# EAGLE design AS3364 bus mixer v2.1 (EAGLE 9.6.2)
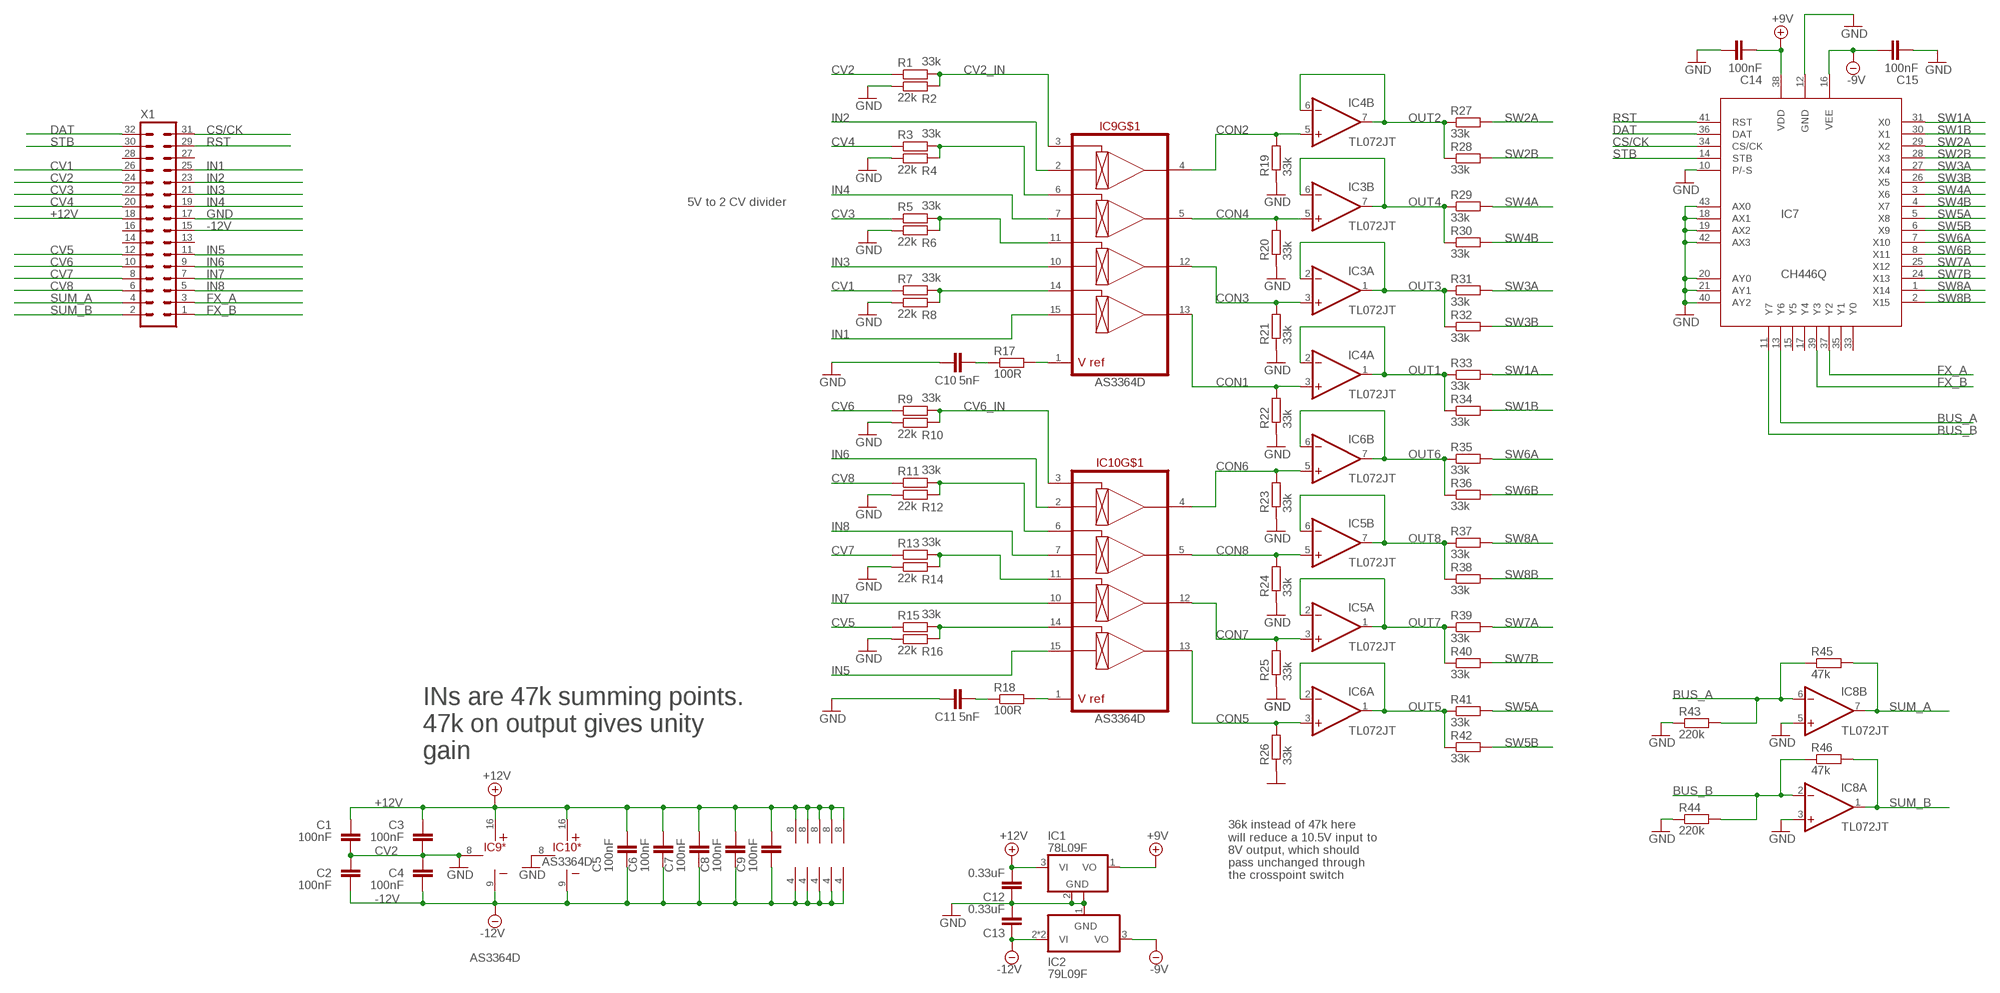
[diagram p0: schematic, sheet 1]

## Parts
C1  100nF  C-EUC0402  [C0402]
C2  100nF  C-EUC0402  [C0402]
C3  100nF  C-EUC0402  [C0402]
C4  100nF  C-EUC0402  [C0402]
C5  100nF  C-EUC0402  [C0402]
C6  100nF  C-EUC0402  [C0402]
C7  100nF  C-EUC0402  [C0402]
C8  100nF  C-EUC0402  [C0402]
C9  100nF  C-EUC0402  [C0402]
C10  5nF  C-EUC0402  [C0402]
C11  5nF  C-EUC0402  [C0402]
C12  0.33uF  C-EUC0603  [C0603]
C13  0.33uF  C-EUC0603  [C0603]
C14  100nF  C-EUC0402  [C0402]
C15  100nF  C-EUC0402  [C0402]
IC1  78L09F  [SOT89]
IC2  79L09F  [SOT89]
IC3  TL072JT  [TSSOP8J]
IC4  TL072JT  [TSSOP8J]
IC5  TL072JT  [TSSOP8J]
IC6  TL072JT  [TSSOP8J]
IC7  CH446Q  [LQFP-44-J]
IC8  TL072JT  [TSSOP8J]
IC9  AS3364D  [DIL16J]
IC10  AS3364D  [DIL16J]
R1  33k  R-EU_R0402  [R0402]
R2  22k  R-EU_R0402  [R0402]
R3  33k  R-EU_R0402  [R0402]
R4  22k  R-EU_R0402  [R0402]
R5  33k  R-EU_R0402  [R0402]
R6  22k  R-EU_R0402  [R0402]
R7  33k  R-EU_R0402  [R0402]
R8  22k  R-EU_R0402  [R0402]
R9  33k  R-EU_R0402  [R0402]
R10  22k  R-EU_R0402  [R0402]
R11  33k  R-EU_R0402  [R0402]
R12  22k  R-EU_R0402  [R0402]
R13  33k  R-EU_R0402  [R0402]
R14  22k  R-EU_R0402  [R0402]
R15  33k  R-EU_R0402  [R0402]
R16  22k  R-EU_R0402  [R0402]
R17  100R  R-EU_R0402  [R0402]
R18  100R  R-EU_R0402  [R0402]
R19  33k  R-EU_R0402  [R0402]
R20  33k  R-EU_R0402  [R0402]
R21  33k  R-EU_R0402  [R0402]
R22  33k  R-EU_R0402  [R0402]
R23  33k  R-EU_R0402  [R0402]
R24  33k  R-EU_R0402  [R0402]
R25  33k  R-EU_R0402  [R0402]
R26  33k  R-EU_R0402  [R0402]
R27  33k  R-EU_R0402  [R0402]
R28  33k  R-EU_R0402  [R0402]
R29  33k  R-EU_R0402  [R0402]
R30  33k  R-EU_R0402  [R0402]
R31  33k  R-EU_R0402  [R0402]
R32  33k  R-EU_R0402  [R0402]
R33  33k  R-EU_R0402  [R0402]
R34  33k  R-EU_R0402  [R0402]
R35  33k  R-EU_R0402  [R0402]
R36  33k  R-EU_R0402  [R0402]
R37  33k  R-EU_R0402  [R0402]
R38  33k  R-EU_R0402  [R0402]
R39  33k  R-EU_R0402  [R0402]
R40  33k  R-EU_R0402  [R0402]
R41  33k  R-EU_R0402  [R0402]
R42  33k  R-EU_R0402  [R0402]
R43  220k  R-EU_R0402  [R0402]
R44  220k  R-EU_R0402  [R0402]
R45  47k  R-EU_R0402  [R0402]
R46  47k  R-EU_R0402  [R0402]
X1  MA16-2WJ  [MA16-2WJ]

## Nets
+9V: C14.1 IC1.1(VO) IC7.38(VDD)
+12V: C1.2 C3.2 C5.2 C6.2 C7.2 C8.2 C9.2 C12.2 IC1.3(VI) IC3.8(P:V+) IC4.8(P:V+) IC5.8(P:V+) IC6.8(P:V+) IC8.8(P:V+) IC9.16(*:V+) IC10.16(*:V+) X1.18
-9V: C15.2 IC2.3(VO) IC7.16(VEE)
-12V: C2.1 C4.1 C5.1 C6.1 C7.1 C8.1 C9.1 C13.1 IC2.2(VI) IC2.2@1(VI) IC3.4(P:V-) IC4.4(P:V-) IC5.4(P:V-) IC6.4(P:V-) IC8.4(P:V-) IC9.9(*:V-) IC10.9(*:V-) X1.15
BUS_A: IC7.13(Y6) IC8.6(B:-IN) R43.2 R45.1
BUS_B: IC7.11(Y7) IC8.2(A:-IN) R44.2 R46.1
CON1: IC4.3(A:+IN) IC9.13(OUT4) R22.2
CON2: IC4.5(B:+IN) IC9.4(OUT1) R19.2
CON3: IC3.3(A:+IN) IC9.12(OUT3) R21.2
CON4: IC3.5(B:+IN) IC9.5(OUT2) R20.2
CON5: IC6.3(A:+IN) IC10.13(OUT4) R26.2
CON6: IC6.5(B:+IN) IC10.4(OUT1) R23.2
CON7: IC5.3(A:+IN) IC10.12(OUT3) R25.2
CON8: IC5.5(B:+IN) IC10.5(OUT2) R24.2
CS/CK: IC7.34(CS/CK) X1.31
CV1: R7.1 X1.26
CV2: R1.1 X1.24
CV2_IN: IC9.3(CV1) R1.2 R2.2
CV3: R5.1 X1.22
CV4: R3.1 X1.20
CV5: R15.1 X1.12
CV6: R9.1 X1.10
CV6_IN: IC10.3(CV1) R9.2 R10.2
CV7: R13.1 X1.8
CV8: R11.1 X1.6
DAT: IC7.36(DAT) X1.32
FX_A: IC7.37(Y2) X1.3
FX_B: IC7.39(Y3) X1.1
GND: C1.1 C2.2 C3.1 C4.2 C10.1 C11.1 C12.1 C13.2 C14.2 C15.1 IC1.2(GND) IC1.2@1(GND) IC2.1(GND) IC7.10(P/-S) IC7.12(GND) IC7.18(AX1) IC7.19(AX2) IC7.20(AY0) IC7.21(AY1) IC7.40(AY2) IC7.42(AX3) IC7.43(AX0) IC8.3(A:+IN) IC8.5(B:+IN) IC9.8(*:GND) IC10.8(*:GND) R2.1 R4.1 R6.1 R8.1 R10.1 R12.1 R14.1 R16.1 R19.1 R20.1 R21.1 R22.1 R23.1 R24.1 R25.1 R26.1 R43.1 R44.1 X1.17
IN1: IC9.15(IN4) X1.25
IN2: IC9.2(IN1) X1.23
IN3: IC9.10(IN3) X1.21
IN4: IC9.7(IN2) X1.19
IN5: IC10.15(IN4) X1.11
IN6: IC10.2(IN1) X1.9
IN7: IC10.10(IN3) X1.7
IN8: IC10.7(IN2) X1.5
N$1: IC10.1(VREF) R18.2
N$2: IC9.1(VREF) R17.2
N$3: IC10.6(CV2) R11.2 R12.2
N$5: IC10.11(CV3) R13.2 R14.2
N$7: IC10.14(CV4) R15.2 R16.2
N$8: C11.2 R18.1
N$10: IC9.6(CV2) R3.2 R4.2
N$12: IC9.11(CV3) R5.2 R6.2
N$14: C10.2 R17.1
N$21: IC9.14(CV4) R7.2 R8.2
OUT1: IC4.1(A:OUT) IC4.2(A:-IN) R33.1 R34.1
OUT2: IC4.6(B:-IN) IC4.7(B:OUT) R27.1 R28.1
OUT3: IC3.1(A:OUT) IC3.2(A:-IN) R31.1 R32.1
OUT4: IC3.6(B:-IN) IC3.7(B:OUT) R29.1 R30.1
OUT5: IC6.1(A:OUT) IC6.2(A:-IN) R41.1 R42.1
OUT6: IC6.6(B:-IN) IC6.7(B:OUT) R35.1 R36.1
OUT7: IC5.1(A:OUT) IC5.2(A:-IN) R39.1 R40.1
OUT8: IC5.6(B:-IN) IC5.7(B:OUT) R37.1 R38.1
RST: IC7.41(RST) X1.29
STB: IC7.14(STB) X1.30
SUM_A: IC8.7(B:OUT) R45.2 X1.4
SUM_B: IC8.1(A:OUT) R46.2 X1.2
SW1A: IC7.31(X0) R33.2
SW1B: IC7.30(X1) R34.2
SW2A: IC7.29(X2) R27.2
SW2B: IC7.28(X3) R28.2
SW3A: IC7.27(X4) R31.2
SW3B: IC7.26(X5) R32.2
SW4A: IC7.3(X6) R29.2
SW4B: IC7.4(X7) R30.2
SW5A: IC7.5(X8) R41.2
SW5B: IC7.6(X9) R42.2
SW6A: IC7.7(X10) R35.2
SW6B: IC7.8(X11) R36.2
SW7A: IC7.25(X12) R39.2
SW7B: IC7.24(X13) R40.2
SW8A: IC7.1(X14) R37.2
SW8B: IC7.2(X15) R38.2
Unconnected: IC7.15(Y5) IC7.17(Y4) IC7.33(Y0) IC7.35(Y1) X1.13 X1.14 X1.16 X1.27 X1.28

## Notes on the sheet
- 5V to 2 CV divider
- INs are 47k summing points.
  47k on output gives unity
  gain
- 36k instead of 47k here 
  will reduce a 10.5V input to
  8V output, which should
  pass unchanged through
  the crosspoint switch

## Library data of the parts
C1-C11 C14 C15 = rcl:C-EU: CAPACITOR, European symbol; SPICEPREFIX: C
C12 C13 = resistor:C-EU: CAPACITOR, European symbol
IC1 = linear:78L*: POSITOIV-VOLTAGE REGULATORS Output up to 100 mA Source: Datasheet <http://focus.ti.com/lit/ds/symlink/ua78l05.pdf>
IC2 = joakim:79L*: NEGATIVE-VOLTAGE REGULATORS Output up to 100 mA
IC3-IC6 IC8 = joakim:TL072J: OP AMP
IC7 = joakim:CH446Q: 8x16 matrix analog switch chip, contains 128 analog switches, used for arbitrary routing of 8x16 signal channels. CH446 supports 4V to 12V single supply voltage, and supports +5V and -7V dual power supply voltage. The ON resistance is not greater than 65Ω. https://www.wch-ic.com/downloads/CH446DS1_PDF.html
IC9 IC10 = joakim:AS3364: AS3364 quad linear VCA, CEM3360 style. CV is 0 to 2V Vcc-Vee = 26V max, so +/-12V or +15V/-9V
R1-R46 = rcl:R-EU_: RESISTOR, European symbol; SPICEPREFIX: R
X1 = joakim:MA16-2WJ: PIN HEADER; OC_FARNELL: unknown; OC_NEWARK: unknown

## Board
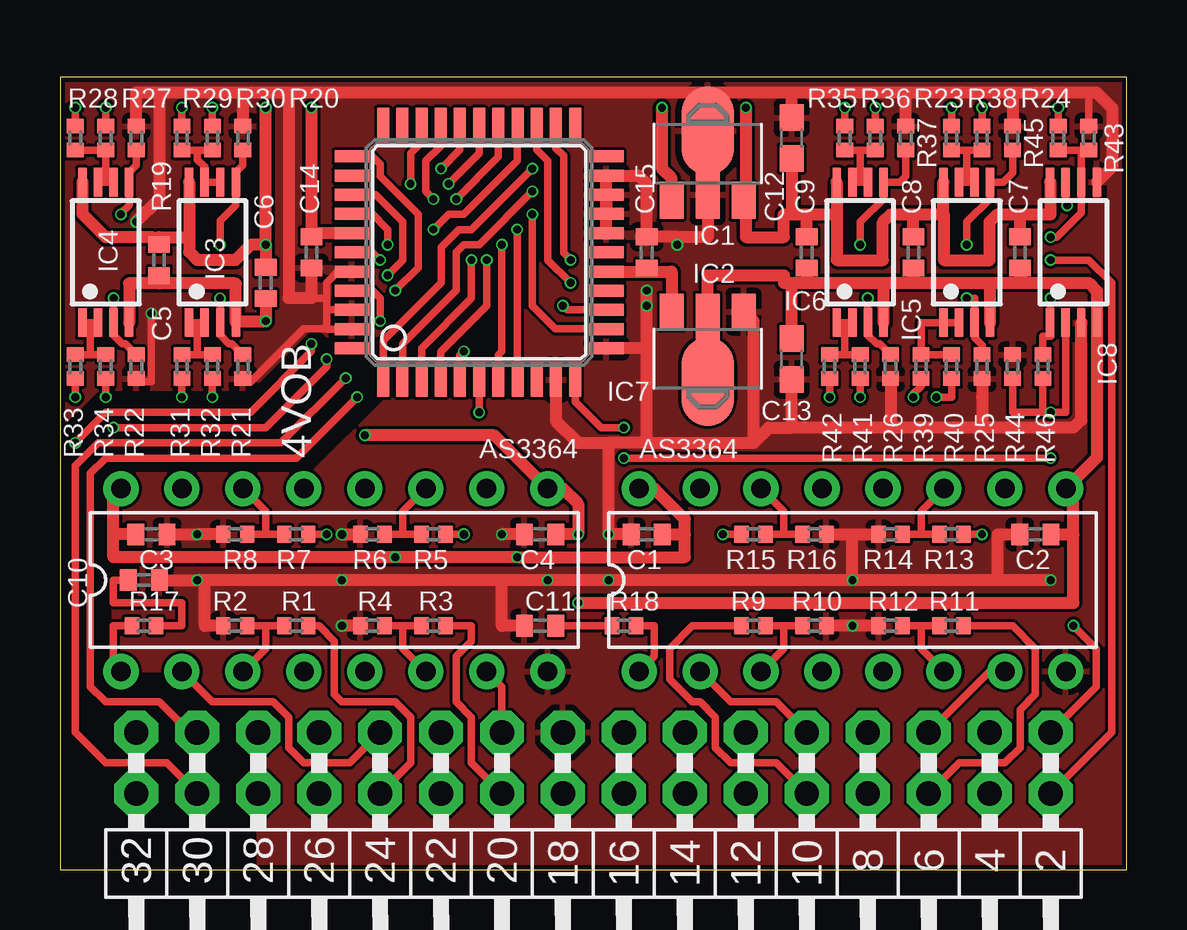
[diagram p1: board, top side]
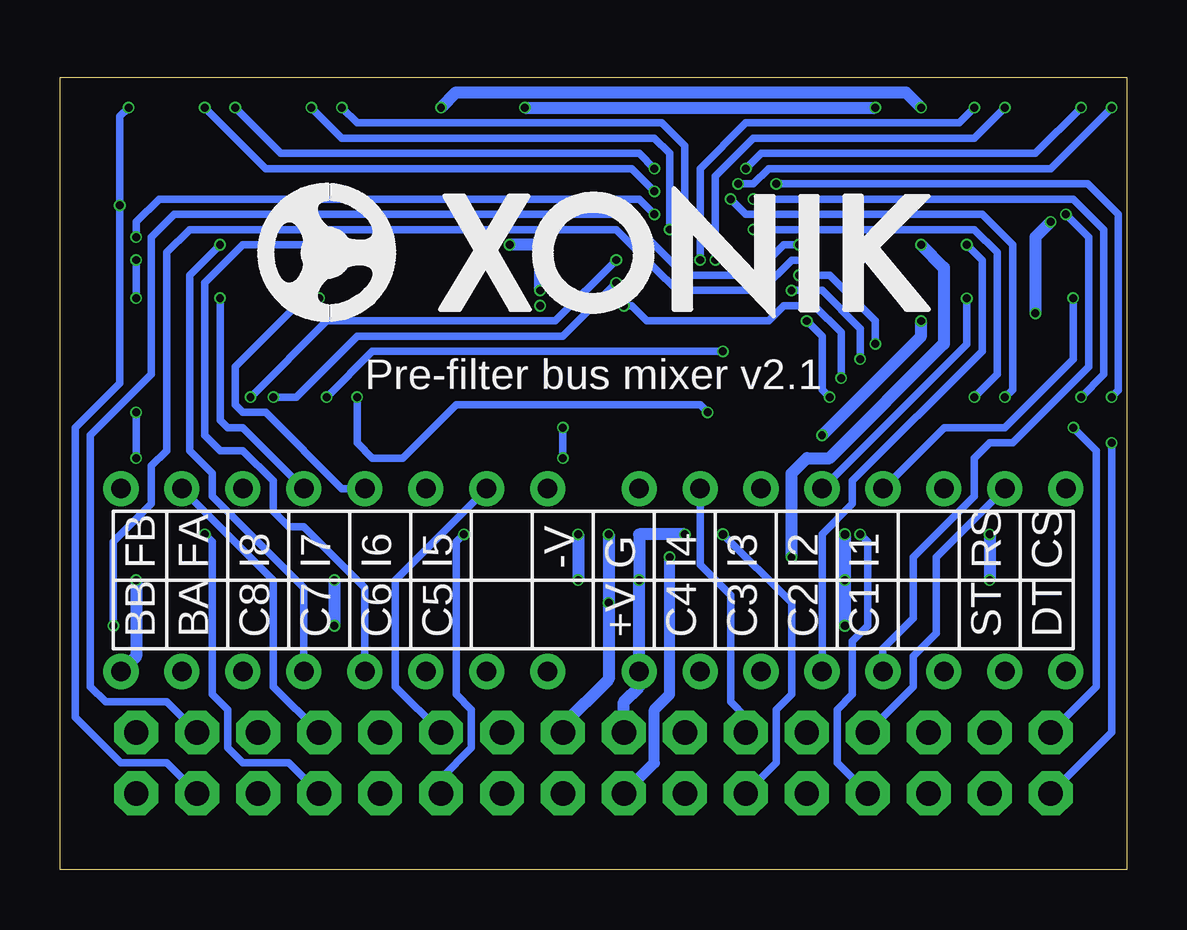
[diagram p2: board, bottom side, seen from below]

Size 44.45 x 33.02 mm. Coordinates in mm from the lower left corner, seen from the top.
Outline: 0,0 44.45,0 44.45,33.02 0,33.02 0,0
Copper layers (1*16): Top 0.035mm / dielectric 1.6mm / Bottom 0.035mm
Design rules "jlcpcb-2layers": minimum track width 5mil, minimum drill 0.3mm, track to track 5mil, track to pad 5mil, pad to pad 5mil, via to via 5mil, smd to smd 5mil, copper to edge 0.2mm, drill to drill 6mil, minimum pad ring 10mil, minimum via ring 3mil, stop-mask expansion 4mil, vias tented up to drill 0mil, thermal gap 10mil

### Footprints (pad centres in the part's own frame; a part is rotated, then mirrored left to right if it is on the bottom)
C0402 = smd 0.7 x 0.9: 1 -0.65,0; 2 0.65,0
C0603 = smd 1.1 x 1: 1 -0.85,0; 2 0.85,0
SOT89 = smd 1 x 1.5: 1 -1.499,-1.981; 3 1.499,-1.981 | smd 1 x 2: 2 0,-1.727 | smd 2.2 x 3.7: 2@1 0,0.94
TSSOP8J = smd 1.2 x 0.35: 1 -2.925,0.975; 2 -2.925,0.325; 3 -2.925,-0.325; 4 -2.925,-0.975; 5 2.925,-0.975; 6 2.925,-0.325; 7 2.925,0.325; 8 2.925,0.975
LQFP-44-J = smd 0.5 x 1.45: 1 -4,-5.3; 2 -3.2,-5.3; 3 -2.4,-5.3; 4 -1.6,-5.3; 5 -0.8,-5.3; 6 0,-5.3; 7 0.8,-5.3; 8 1.6,-5.3; 9 2.4,-5.3; 10 3.2,-5.3; 11 4,-5.3; 23 4,5.3; 24 3.2,5.3; 25 2.4,5.3; 26 1.6,5.3; 27 0.8,5.3; 28 0,5.3; 29 -0.8,5.3; 30 -1.6,5.3; 31 -2.4,5.3; 32 -3.2,5.3; 33 -4,5.3 | smd 1.45 x 0.5: 12 5.3,-4; 13 5.3,-3.2; 14 5.3,-2.4; 15 5.3,-1.6; 16 5.3,-0.8; 17 5.3,0; 18 5.3,0.8; 19 5.3,1.6; 20 5.3,2.4; 21 5.3,3.2; 22 5.3,4; 34 -5.3,4; 35 -5.3,3.2; 36 -5.3,2.4; 37 -5.3,1.6; 38 -5.3,0.8; 39 -5.3,0; 40 -5.3,-0.8; 41 -5.3,-1.6; 42 -5.3,-2.4; 43 -5.3,-3.2; 44 -5.3,-4
DIL16J = drill 0.813: 1 -8.89,-3.81; 2 -6.35,-3.81; 3 -3.81,-3.81; 4 -1.27,-3.81; 5 1.27,-3.81; 6 3.81,-3.81; 7 6.35,-3.81; 8 8.89,-3.81; 9 8.89,3.81; 10 6.35,3.81; 11 3.81,3.81; 12 1.27,3.81; 13 -1.27,3.81; 14 -3.81,3.81; 15 -6.35,3.81; 16 -8.89,3.81
R0402 = smd 0.6 x 0.7: 1 -0.5,0; 2 0.5,0
MA16-2WJ = drill 1.016 octagon: 1 -20.32,-1.27; 2 -20.32,1.27; 3 -17.78,-1.27; 4 -17.78,1.27; 5 -15.24,-1.27; 6 -15.24,1.27; 7 -12.7,-1.27; 8 -12.7,1.27; 9 -10.16,-1.27; 10 -10.16,1.27; 11 -7.62,-1.27; 12 -7.62,1.27; 13 -5.08,-1.27; 14 -5.08,1.27; 15 -2.54,-1.27; 16 -2.54,1.27; 17 0,-1.27; 18 0,1.27; 19 2.54,-1.27; 20 2.54,1.27; 21 5.08,-1.27; 22 5.08,1.27; 23 7.62,-1.27; 24 7.62,1.27; 25 10.16,-1.27; 26 10.16,1.27; 27 12.7,-1.27; 28 12.7,1.27; 29 15.24,-1.27; 30 15.24,1.27; 31 17.78,-1.27; 32 17.78,1.27

### Placement (x,y rotation side)
C1  24.45,13.97 0 top
C2  40.64,13.97 180 top
C3  3.81,13.97 180 top
C4  20,13.97 180 top
C5  4.13,25.4 90 top
C6  8.57,24.45 90 top
C7  40.01,25.72 90 top
C8  35.56,25.72 90 top
C9  31.11,25.72 90 top
C10  3.49,12.06 180 top
C11  20,10.16 0 top
C12  30.48,30.48 270 top
C13  30.48,21.27 270 top
C14  10.48,25.72 270 top
C15  24.45,25.72 270 top
IC1  26.99,29.85 0 top
IC2  26.99,21.27 180 top
IC3  6.35,25.72 90 top
IC4  1.91,25.72 90 top
IC5  37.78,25.72 90 top
IC6  33.34,25.72 90 top
IC7  17.46,25.72 0 top
IC8  42.23,25.72 90 top
IC9  11.43,12.06 0 top
IC10  33.02,12.06 0 top
R1  9.84,10.16 180 top
R2  7.3,10.16 0 top
R3  15.56,10.16 180 top
R4  13.02,10.16 0 top
R5  15.56,13.97 180 top
R6  13.02,13.97 0 top
R7  9.84,13.97 180 top
R8  7.3,13.97 0 top
R9  28.89,10.16 0 top
R10  31.43,10.16 180 top
R11  37.15,10.16 180 top
R12  34.61,10.16 0 top
R13  37.15,13.97 180 top
R14  34.61,13.97 0 top
R15  28.89,13.97 0 top
R16  31.43,13.97 180 top
R17  3.49,10.16 180 top
R18  23.5,10.16 0 top
R19  3.17,30.48 270 top
R20  7.62,30.48 270 top
R21  7.62,20.96 90 top
R22  3.17,20.96 90 top
R23  35.24,30.48 270 top
R24  39.69,30.48 270 top
R25  38.42,20.96 90 top
R26  34.61,20.96 90 top
R27  1.91,30.48 90 top
R28  0.64,30.48 90 top
R29  5.08,30.48 90 top
R30  6.35,30.48 90 top
R31  5.08,20.96 270 top
R32  6.35,20.96 270 top
R33  0.64,20.96 270 top
R34  1.91,20.96 270 top
R35  32.7,30.48 90 top
R36  33.97,30.48 90 top
R37  37.15,30.48 90 top
R38  38.42,30.48 90 top
R39  35.88,20.96 270 top
R40  37.15,20.96 270 top
R41  33.34,20.96 270 top
R42  32.07,20.96 270 top
R43  42.86,30.48 270 top
R44  39.69,20.96 270 top
R45  41.59,30.48 90 top
R46  40.96,20.96 90 top
U$1  [XONIK_LOGO_28]  36.2,22.86 0 bottom
X1  20.95,4.45 180 top

### Tracks (layer width: path | path; a pad name or v marks a point on that pad's centre or on a via)
+9V  (via drill 0.33)
  Top 0.508: IC1.1 25.49,28.8 25.08,29.21 v25.08,31.75 | v10.48,31.75 C14.1 10.63,26.52 IC7.38
  Bottom 0.508: v25.08,31.75 v10.48,31.75
+12V  (via drill 0.33)
  Top 0.508: C1.2 26.04,13.97 | 26.04,13.97 26.04,14.6 24.77,15.87 IC10.16 | 26.04,13.97 26.04,13.02 v19.05,13.02 v13.97,13.02 2.22,13.02 2.22,13.97 | 2.22,13.97 2.22,15.56 IC9.16 | C3.2 2.22,13.97 | IC4.8 0.93,27.33 1.91,26.35 3.83,26.35 C5.2 4.13,26.35 5.38,26.35 | v8.57,26.03 7.94,26.03 7.3,25.4 5.71,25.4 5.38,25.74 5.38,26.35 | IC6.8 32.36,27.3 | 40.01,27.3 41.27,27.3 41.27,28.62 IC8.8 | 36.81,27.3 IC5.8 | C9.2 31.11,27.3 | 31.11,27.3 32.36,27.3 | 30.48,27.3 30.16,27.3 30.16,26.35 28.57,26.35 28.57,27.78 IC1.3 28.57,27.95 v28.57,31.75 | 30.48,27.3 31.11,27.3 | C12.2 30.48,27.3 | IC3.8 5.38,26.35 | C7.2 40.01,27.3 | 40.01,27.3 39.05,27.3 38.73,26.99 38.73,25.4 36.83,25.4 36.83,27.28 36.81,27.3 | v8.57,26.03 C6.2 | v8.57,26.03 v8.57,31.75 | 32.36,27.3 32.36,25.42 32.38,25.4 34.29,25.4 34.29,26.99 34.61,27.3 35.56,27.3 | 35.56,27.3 36.81,27.3 | C8.2 35.56,27.3
  Bottom 0.457: X1.18 19.68,4.45 19.68,6.67 19.05,7.3 v19.05,13.02
  Bottom 0.508: v8.57,26.03 7.62,25.08 7.62,21.91 12.38,17.14 13.34,17.14 13.97,16.51 v13.97,13.02 | v28.57,31.75 27.94,32.39 9.21,32.39 v8.57,31.75
-9V
  Top 0.508: IC2.3 25.49,24.92 24.45,24.92 | IC7.16 24.45,24.92 | C15.2 24.45,24.92
-12V  (via drill 0.33)
  Top 0.305: IC2.2 IC2.2@1
  Top 0.508: C4.1 v21.59,13.97 21.59,15.24 20.95,15.87 IC9.9 18.1,18.1 v12.7,18.1 | 42.23,13.97 42.23,11.11 v21.59,11.11 | C2.1 42.23,13.97 | 42.23,13.97 42.23,15.56 IC10.9 43.2,17.17 IC8.4 43.2,24.11 42.86,24.45 40.01,24.45 | 7.33,22.84 8.57,22.84 C6.1 v8.57,22.86 | 4.13,24.42 7.3,24.42 7.33,24.4 7.33,22.84 | 4.13,24.42 2.88,24.42 IC4.4 | C5.1 4.13,24.42 | C9.1 31.11,24.45 | 31.11,24.45 34.29,24.45 | IC2.2 26.99,24.76 30.16,24.76 30.16,24.45 30.48,24.45 | 30.48,24.45 31.11,24.45 | C13.1 30.48,24.45 | IC3.4 7.33,22.84 | 34.29,24.45 34.31,24.42 IC6.4 | 34.29,24.45 35.56,24.45 | 35.56,24.45 38.73,24.45 | 38.73,24.45 40.01,24.45 | C7.1 40.01,24.45 | C8.1 35.56,24.45 | 38.73,24.45 38.76,24.42 IC5.4
  Bottom 0.508: X1.15 23.5,6.03 21.59,7.94 v21.59,11.11 v21.59,13.97 | v12.7,18.1 8.57,22.23 v8.57,22.86
BUS_A  (via drill 0.33)
  Top 0.305: IC7.13 22.74,22.54 20.64,22.54 19.68,23.49 v19.68,27.3 | v41.27,26.35 41.53,26.35 42.55,27.37 IC8.6 42.55,29.98 | R45.1 42.55,29.98 | 42.55,29.98 R43.2
  Bottom 0.305: v41.27,26.35 41.27,26.99 40.32,27.94 20.32,27.94 v19.68,27.3
BUS_B  (via drill 0.33)
  Top 0.305: IC7.11 21.46,19.49 22.54,18.42 v23.5,18.42 | v23.5,17.14 v41.27,17.14 | IC8.2 41.9,21.56 41.9,21.55 41.9,19.05 v41.27,19.05 40.96,19.05 | R44.2 39.69,19.05 40.96,19.05 | R46.1 40.96,19.05
  Bottom 0.305: v23.5,18.42 v23.5,17.14 | v41.27,17.14 v41.27,19.05
CON1  (via drill 0.33)
  Top 0.305: v2.23,23.81 2.22,23.81 IC4.3 2.23,22.27 2.59,21.91 2.72,21.91 R22.2
  Bottom 0.305: IC9.13 7.61,18.42 5.08,18.42 2.23,21.26 v2.23,23.81
CON2  (via drill 0.33)
  Top 0.305: R19.2 3.17,29.35 2.88,29.05 IC4.5 2.88,27.69 2.54,27.35 v2.54,27.3
  Bottom 0.305: IC9.4 10.16,9.21 8.89,10.48 8.89,13.02 6.35,15.56 6.35,17.14 5.71,17.78 4.76,17.78 1.59,20.96 1.59,26.35 v2.54,27.3
CON3  (via drill 0.33)
  Top 0.305: IC3.3 6.67,22.86 v6.67,23.8 | R21.2 7.16,21.91 7.03,21.91 6.67,22.28 IC3.3 | IC3.3
  Bottom 0.305: IC9.12 6.67,21.9 v6.67,23.8
CON4  (via drill 0.33)
  Top 0.305: v6.67,26.03 6.67,27.03 7.33,27.69 IC3.5 7.33,29.05 7.62,29.35 R20.2
  Bottom 0.305: IC9.5 12.7,13.97 11.43,15.24 11.43,16.19 6.03,21.59 6.03,25.4 v6.67,26.03
CON5  (via drill 0.33)
  Top 0.305: v33.66,23.81 33.66,23.18 IC6.3 33.66,22.27 34.02,21.91 34.15,21.91 R26.2
  Bottom 0.305: IC10.13 32.7,15.87 35.88,19.05 36.83,19.05 37.15,19.37 37.15,20.96 34.29,23.81 v33.66,23.81
CON6  (via drill 0.33)
  Top 0.305: v33.34,26.03 33.34,26.99 34.31,27.96 IC6.5 34.99,28.64 35.24,28.89 R23.2
  Bottom 0.305: IC10.4 31.75,11.75 34.29,14.29 34.92,14.29 35.56,14.92 35.56,16.19 36.83,17.46 37.78,17.46 38.42,18.1 38.42,24.45 36.83,26.03 v33.34,26.03
CON7  (via drill 0.33)
  Top 0.305: v37.78,23.81 38.1,23.81 38.11,23.8 IC5.3 38.11,22.16 38.42,21.85 R25.2
  Bottom 0.305: v37.78,23.81 37.78,18.73 37.47,18.42 36.83,18.42 IC10.12
CON8  (via drill 0.33)
  Top 0.305: v37.78,26.03 37.78,26.99 38.76,27.96 IC5.5 39.3,28.64 39.69,29.03 R24.2
  Bottom 0.305: IC10.5 34.29,11.75 38.1,15.56 38.1,16.51 39.05,17.46 39.05,24.76 v37.78,26.03
CS/CK  (via drill 0.33)
  Top 0.305: v2.22,18.42 8.57,18.42 11.11,20.96 v11.11,21.27 | IC7.34 13.02,29.72 13.34,29.4 13.34,28.89 14.92,27.3 14.92,25.08 v13.97,24.13
  Bottom 0.305: X1.31 1.27,7.62 1.27,17.46 v2.22,18.42 | v13.97,24.13 12.7,24.13 11.11,22.54 v11.11,21.27
CV1  (via drill 0.33)
  Top 0.305: v11.11,13.97 R7.1
  Bottom 0.305: X1.26 12.06,4.45 12.06,6.67 11.43,7.3 11.43,9.52 10.79,10.16 10.79,13.65 v11.11,13.97
CV2
  Top 0.305: X1.24 14.61,4.45 14.61,6.35 13.97,6.99 11.75,6.99 11.43,7.3 11.43,9.52 10.79,10.16 R1.1
CV2_IN
  Top 0.305: 8.57,10.16 8.57,9.21 IC9.3 | R1.2 8.57,10.16 | 8.57,10.16 R2.2
CV3  (via drill 0.35)
  Top 0.305: v16.83,13.97 R5.1
  Bottom 0.305: X1.22 14.61,4.45 14.61,6.67 13.97,7.3 13.97,11.11 v16.83,13.97
CV4
  Top 0.305: X1.20 17.14,4.45 17.14,6.35 16.51,6.99 16.51,8.89 17.14,9.52 17.14,10.16 R3.1
CV5  (via drill 0.33)
  Top 0.305: v27.62,13.97 R15.1
  Bottom 0.305: X1.12 28.57,3.81 27.3,5.08 27.3,6.67 27.94,7.3 27.94,13.65 v27.62,13.97
CV6
  Top 0.305: X1.10 29.84,4.45 27.94,4.45 27.3,5.08 27.3,6.35 26.67,6.99 26.35,6.99 25.4,7.94 25.4,9.21 26.35,10.16 R9.1
CV6_IN
  Top 0.305: R9.2 30.16,10.16 | 30.16,10.16 R10.2 | IC10.3 30.16,9.21 30.16,10.16
CV7  (via drill 0.33)
  Top 0.305: v38.42,13.97 R13.1
  Bottom 0.305: v38.42,13.97 38.1,13.65 38.1,7.3 37.47,6.67 37.47,5.08 36.83,4.45 34.92,4.45 X1.8
CV8
  Top 0.305: R11.1 39.69,10.16 40.64,9.21 40.64,7.3 40.01,6.67 40.01,5.08 39.37,4.45 37.47,4.45 X1.6
DAT  (via drill 0.33)
  Top 0.305: v0.64,17.78 1.91,19.05 7.94,19.05 10.48,21.59 v10.48,21.91 | IC7.36 13.16,28.12 14.29,26.99 14.29,25.4 v13.65,24.76
  Bottom 0.305: v0.64,17.78 0.64,5.71 X1.32 | v13.65,24.76 12.38,24.76 10.48,22.86 v10.48,21.91
FX_A  (via drill 0.33)
  Top 0.305: IC7.37 13.01,27.32 13.65,26.67 v13.65,26.03
  Bottom 0.305: v13.65,26.03 14.29,26.03 15.56,24.76 18.41,24.76 20.95,27.3 39.69,27.3 40.64,26.35 40.64,20.64 43.18,18.1 43.18,7.62 42.55,6.99 40.01,6.99 X1.3
FX_B  (via drill 0.33)
  Top 0.305: IC7.39 13.02,25.72 v13.34,25.4 | X1.1 43.18,7.62 43.18,9.21 v42.23,10.16
  Bottom 0.305: v13.34,25.4 13.97,25.4 15.24,24.13 18.73,24.13 19.68,25.08 21.27,26.67 39.05,26.67 40.01,25.72 40.01,17.46 40.64,16.83 40.64,15.24 42.23,13.65 v42.23,10.16
GND  (via drill 0.33, 0.35)
  Top 0.305: 7.62,31.12 R20.1 | 3.17,31.12 R19.1 | IC7.40 11.58,24.92 11.11,24.45 11.11,23.81 | 11.11,23.81 11.11,23.32 | 11.11,22.54 11.11,22.52 IC7.43 | IC7.42 11.11,23.32 | v3.81,23.18 3.81,20.32 3.31,20.32 R22.1 | 11.11,22.54 10.16,22.54 7.94,20.32 7.75,20.32 R21.1 | 11.11,23.81 10.48,23.81 | 11.11,23.32 11.11,22.54 | R43.1 42.86,32.39
  Top 0.508: R4.1 v11.75,10.16 | v11.75,13.97 R6.1 | v33.02,12.07 v22.86,12.07 v20.32,12.07 18.41,12.07 | 18.41,12.07 v11.75,12.07 6.03,12.07 | C4.2 v18.41,13.97 | 6.03,12.07 v5.71,12.07 C10.1 | C11.1 18.41,10.16 18.41,12.07 | R16.1 33.02,13.97 | 33.02,13.97 R14.1 | v33.02,12.07 33.02,13.97 | C2.2 39.05,13.97 39.05,12.07 | 39.05,12.07 v33.02,12.07 | v41.27,12.07 39.05,12.07 | C1.1 v22.86,13.97 22.86,17.78 | R12.1 v33.02,10.16 R10.1 | R2.1 6.03,10.16 6.03,12.07 | R8.1 v5.71,13.97 C3.1 | 3.17,31.12 3.17,32.39 4.13,32.39 | 7.62,32.39 7.62,31.12 | 7.62,32.39 9.53,32.39 | 9.53,32.39 26.99,32.39 | 26.99,32.39 30.48,32.39 | 30.48,32.39 35.24,32.39 | 35.24,32.39 39.69,32.39 | 39.69,32.39 R24.1 | R23.1 35.24,32.39 | 39.69,32.39 42.86,32.39 43.18,32.39 43.84,31.73 43.84,29.28 IC8.5 | 4.13,32.39 4.13,27.94 v3.17,26.99 | 9.53,32.39 9.53,23.81 10.48,23.81 C14.2 | C12.1 30.48,32.39 | R25.1 38.42,19.69 | 38.42,19.69 38.42,18.42 | 38.42,18.42 42.23,18.42 42.55,18.74 IC8.3 | 38.42,18.42 34.61,18.42 | 34.61,18.42 30.48,18.42 | 30.48,18.42 C13.2 | R26.1 34.61,18.42 | IC2.1 28.89,22.86 28.89,17.78 | 30.48,18.42 29.53,18.42 28.89,17.78 | 24.45,17.78 22.86,17.78 | 24.45,17.78 24.45,21.59 | 24.45,21.59 v24.45,24.13 | 25.72,26.35 26.99,26.35 IC1.2 IC1.2@1 26.99,32.39 | v25.72,26.03 25.72,26.35 | IC7.10 20.66,18.71 21.59,17.78 22.86,17.78 | 24.45,21.59 24.32,21.72 IC7.12 | IC7.18 IC7.19 | IC7.19 IC7.21 24.11,28.92 24.45,28.57 C15.1 25.7,26.37 25.72,26.35 | IC7.20 IC7.19 | 24.45,17.78 28.89,17.78 | 4.13,32.39 7.62,32.39 | 38.42,19.69
  Bottom 0.508: v18.41,13.97 20.32,13.97 v20.32,12.07 IC9.8 20.32,7.62 20.95,6.99 X1.17 | v11.75,13.97 v11.75,12.07 v11.75,10.16 | IC10.8 41.27,8.89 v41.27,12.07 | v22.86,13.97 v22.86,12.07 | v33.02,12.07 v33.02,10.16 | v5.71,13.97 v5.71,12.07 | v3.17,26.99 3.81,26.35 v3.81,23.18 | v24.45,24.13 24.45,26.03 v25.72,26.03
  other vias: 24.45,23.5
  pour Top: -0.32,33.02 44.77,33.02 44.77,-0.32 8.26,-0.32 8.26,5.08 5.08,8.25 2.22,8.25 2.22,15.56 3.17,16.51 10.48,16.51 13.65,19.69 10.79,22.54 10.48,22.54 7.94,20 1.59,20 -0.32,18.1
IN1
  Bottom 0.305: IC9.15 7.94,13.02 7.94,9.84 8.89,8.89 8.89,7.62 X1.25
IN2
  Top 0.305: IC9.2 6.35,6.99 8.89,6.99 9.53,6.35 9.53,5.08 10.16,4.45 12.06,4.45 X1.23
IN3
  Bottom 0.305: X1.21 15.88,6.35 16.51,6.99 16.51,11.43 17.78,12.7 IC9.10
IN4
  Top 0.305: X1.19 18.41,7.62 IC9.7
IN5
  Bottom 0.305: IC10.15 30.48,12.07 30.48,7.62 X1.11
IN6
  Top 0.305: IC10.2 27.94,6.99 29.84,6.99 X1.9
IN7
  Bottom 0.305: X1.7 35.56,7.62 35.56,12.07 IC10.10
IN8
  Top 0.305: X1.5 38.73,8.25 IC10.7
N$1
  Top 0.305: IC10.1 24.77,8.89 24.77,10.16 R18.2
N$2
  Top 0.305: IC9.1 2.22,8.57 2.22,10.16 R17.2
N$3
  Top 0.305: R11.2 35.88,10.16 | 35.88,10.16 R12.2 | IC10.6 35.88,9.21 35.88,10.16
N$5
  Top 0.305: R14.2 35.88,13.97 | R13.2 35.88,13.97 | IC10.11 35.88,14.92 35.88,13.97
N$7
  Top 0.305: R15.2 30.16,13.97 | 30.16,13.97 R16.2 | IC10.14 30.16,14.92 30.16,13.97
N$8
  Top 0.305: C11.2 R18.1
N$10
  Top 0.305: R4.2 R3.2 14.29,10.16 14.29,9.21 IC9.6
N$12
  Top 0.305: 14.29,13.97 14.29,14.92 IC9.11 | R5.2 14.29,13.97 | 14.29,13.97 R6.2
N$14
  Top 0.305: C10.2 2.22,12.07 2.22,11.11 5.08,11.11 5.08,10.16 R17.1
N$21
  Top 0.305: 8.57,13.97 8.57,14.92 IC9.14 | R7.2 8.57,13.97 | 8.57,13.97 R8.2
OUT1
  Top 0.305: IC4.1 1.27,22.79 | 1.27,22.79 IC4.2 | R33.1 1.27,21.46 | 1.27,21.46 R34.1 | 1.27,21.46 1.27,22.79
OUT2
  Top 0.305: R27.1 1.9,29.97 | 1.9,29.97 1.9,28.64 IC4.7 IC4.6 | R28.1 1.89,29.98 1.9,29.97
OUT3
  Top 0.305: IC3.2 5.71,22.79 | 5.71,22.79 IC3.1 | R31.1 5.71,21.46 | 5.71,21.46 R32.1 | 5.71,21.46 5.71,22.79
OUT4
  Top 0.305: IC3.6 IC3.7 6.03,29.28 5.71,29.59 5.71,29.98 | R30.1 5.71,29.98 | 5.71,29.98 R29.1
OUT5
  Top 0.305: IC6.1 32.7,22.79 | 32.7,22.79 IC6.2 | R42.1 32.7,21.46 | 32.7,21.46 R41.1 | 32.7,21.46 32.7,22.79
OUT6
  Top 0.305: IC6.7 33.34,28.64 | 33.34,28.64 IC6.6 | R35.1 R36.1 33.34,29.98 33.34,28.64
OUT7
  Top 0.305: IC5.2 IC5.1 35.88,22.79 R39.1 R40.1
OUT8
  Top 0.305: IC5.7 37.78,28.64 | 37.78,28.64 IC5.6 | R38.1 R37.1 37.78,29.98 37.78,28.64
RST  (via drill 0.33)
  Top 0.305: X1.29 5.4,5.71 4.13,6.99 1.91,6.99 1.27,7.62 1.27,16.51 1.91,17.14 9.84,17.14 v12.38,19.69 | IC7.41 13.03,24.12 13.34,23.81 v13.34,22.86
  Bottom 0.305: v13.34,22.86 12.7,22.23 12.7,20 v12.38,19.69
STB  (via drill 0.33)
  Top 0.305: X1.30 4.45,4.45 1.91,4.45 0.64,5.71 0.64,16.83 1.59,17.78 9.21,17.78 v11.91,20.48 | v20.95,23.49 21.13,23.32 IC7.14
  Bottom 0.305: v11.91,20.48 11.91,22.38 13.02,23.49 14.29,23.49 14.92,22.86 20,22.86 20.64,23.49 v20.95,23.49
SUM_A  (via drill 0.33)
  Top 0.305: R45.2 v41.59,31.75 | IC8.7 41.91,27.62 v41.96,27.67
  Bottom 0.305: v41.59,31.75 41.96,31.38 v41.96,27.67 41.96,20.27 43.81,18.42 43.81,6.35 41.91,4.45 40.01,4.45 X1.4
SUM_B  (via drill 0.33)
  Top 0.305: R46.2 40.96,22.23 41.27,22.23 41.27,22.57 41.27,22.77 IC8.1 41.25,23.81 v41.27,23.81 | X1.2 43.81,5.71 43.81,24.45 42.86,25.4 v41.27,25.4
  Bottom 0.305: v41.27,25.4 v41.27,23.81
SW1A  (via drill 0.33)
  Top 0.305: v0.64,19.69 R33.2 | v14.61,28.57 14.61,29.85 15.06,30.3 IC7.31
  Bottom 0.305: v0.64,19.69 0.35,19.97 0.35,27.3 1.62,28.57 v14.61,28.57
SW1B  (via drill 0.33)
  Top 0.305: v1.91,19.69 R34.2 | v15.56,27.94 15.24,28.26 15.24,29.53 15.86,30.15 IC7.30
  Bottom 0.305: v1.91,19.69 0.95,20.64 0.95,26.67 2.22,27.94 v15.56,27.94
SW2A  (via drill 0.33)
  Top 0.305: v1.91,31.75 R27.2 | v15.88,29.21 16.66,30 IC7.29
  Bottom 0.305: v1.91,31.75 3.81,29.85 15.24,29.85 v15.88,29.21
SW2B  (via drill 0.33)
  Top 0.305: R28.2 v0.64,31.75 | IC7.28 17.46,29.85 v16.19,28.57
  Bottom 0.305: v0.64,31.75 3.17,29.21 14.92,29.21 15.56,28.57 v16.19,28.57
SW3A  (via drill 0.33)
  Top 0.305: R31.2 v5.08,19.69 | v16.51,27.94 18.26,29.69 IC7.27
  Bottom 0.305: v16.51,27.94 15.88,27.3 6.03,27.3 4.76,26.03 4.76,20 v5.08,19.69
SW3B  (via drill 0.33)
  Top 0.305: R32.2 v6.35,19.69 | IC7.26 19.05,31.01 19.05,29.53 16.83,27.3 16.19,27.3 v15.56,26.67
  Bottom 0.305: v6.35,19.69 5.4,20.64 5.4,25.72 6.35,26.67 v15.56,26.67
SW4A  (via drill 0.33)
  Top 0.305: v5.08,31.75 R29.2 | v17.14,25.4 17.14,23.81 15.06,21.73 IC7.3
  Bottom 0.305: v5.08,31.75 6.35,30.48 15.56,30.48 17.14,28.89 v17.14,25.4
SW4B  (via drill 0.33)
  Top 0.305: R30.2 v6.35,31.75 | v17.78,25.4 17.78,23.49 15.86,21.58 IC7.4
  Bottom 0.305: v6.35,31.75 6.99,31.12 15.88,31.12 17.78,29.21 v17.78,25.4
SW5A  (via drill 0.33)
  Top 0.305: R41.2 v33.34,19.69 | IC7.5 16.66,21.42 v16.83,21.59
  Bottom 0.305: v33.34,19.69 31.43,21.59 v16.83,21.59
SW5B  (via drill 0.33)
  Top 0.305: R42.2 v32.07,19.69 | v17.46,19.05 IC7.6
  Bottom 0.305: v32.07,19.69 32.07,17.78 31.43,17.14 30.16,17.14 27.94,19.37 17.78,19.37 v17.46,19.05
SW6A  (via drill 0.33)
  Top 0.305: R35.2 v32.7,31.75 | IC7.7 18.26,21.44 18.41,21.59 v18.41,26.03
  Bottom 0.305: v32.7,31.75 32.07,31.12 19.37,31.12 18.41,30.16 v18.41,26.03
SW6B  (via drill 0.33)
  Top 0.305: R36.2 v33.97,31.75 | v19.05,26.67 19.05,20.43 IC7.8
  Bottom 0.305: v33.97,31.75 32.7,30.48 19.68,30.48 19.05,29.85 v19.05,26.67
SW7A  (via drill 0.33)
  Top 0.305: R39.2 35.88,20.14 35.56,19.82 v35.56,19.69 | v21.27,24.45 20.32,25.4 20.32,29.53 19.86,29.98 IC7.25
  Bottom 0.305: v35.56,19.69 34.61,19.69 32.07,22.23 23.5,22.23 v21.27,24.45
SW7B  (via drill 0.33)
  Top 0.305: R40.2 37.15,19.69 v36.51,19.69 | v21.27,25.4 20.98,25.69 20.98,29.75 20.66,30.07 IC7.24
  Bottom 0.305: v36.51,19.69 33.34,22.86 23.81,22.86 v21.27,25.4
SW8A  (via drill 0.33)
  Top 0.305: R37.2 v37.15,31.75 | IC7.1 13.46,22.03 15.88,24.45 15.88,25.93 16.61,26.67 17.14,26.67 v19.68,29.21
  Bottom 0.305: v37.15,31.75 35.24,29.85 20.32,29.85 v19.68,29.21
SW8B  (via drill 0.33)
  Top 0.305: R38.2 v38.42,31.75 | IC7.2 14.26,21.25 14.29,21.27 14.29,21.91 16.51,24.13 16.51,25.72 16.83,26.03 17.46,26.03 v19.68,28.26
  Bottom 0.305: v38.42,31.75 35.88,29.21 20.64,29.21 v19.68,28.26

### Text on the board
tNames: 4VOB | AS3364 | AS3364
bNames: Pre-filter bus mixer v2.1 | CS | RS | I1 | I2 | I3 | I4 | G | -V | I5 | I6 | I7 | I8 | FA | FB | DT | ST | C1 | C2 | C3 | C4 | +V | C5 | C6 | C7 | C8 | BA | BB